# EAGLE design serial_max232 (EAGLE 8.0.1)
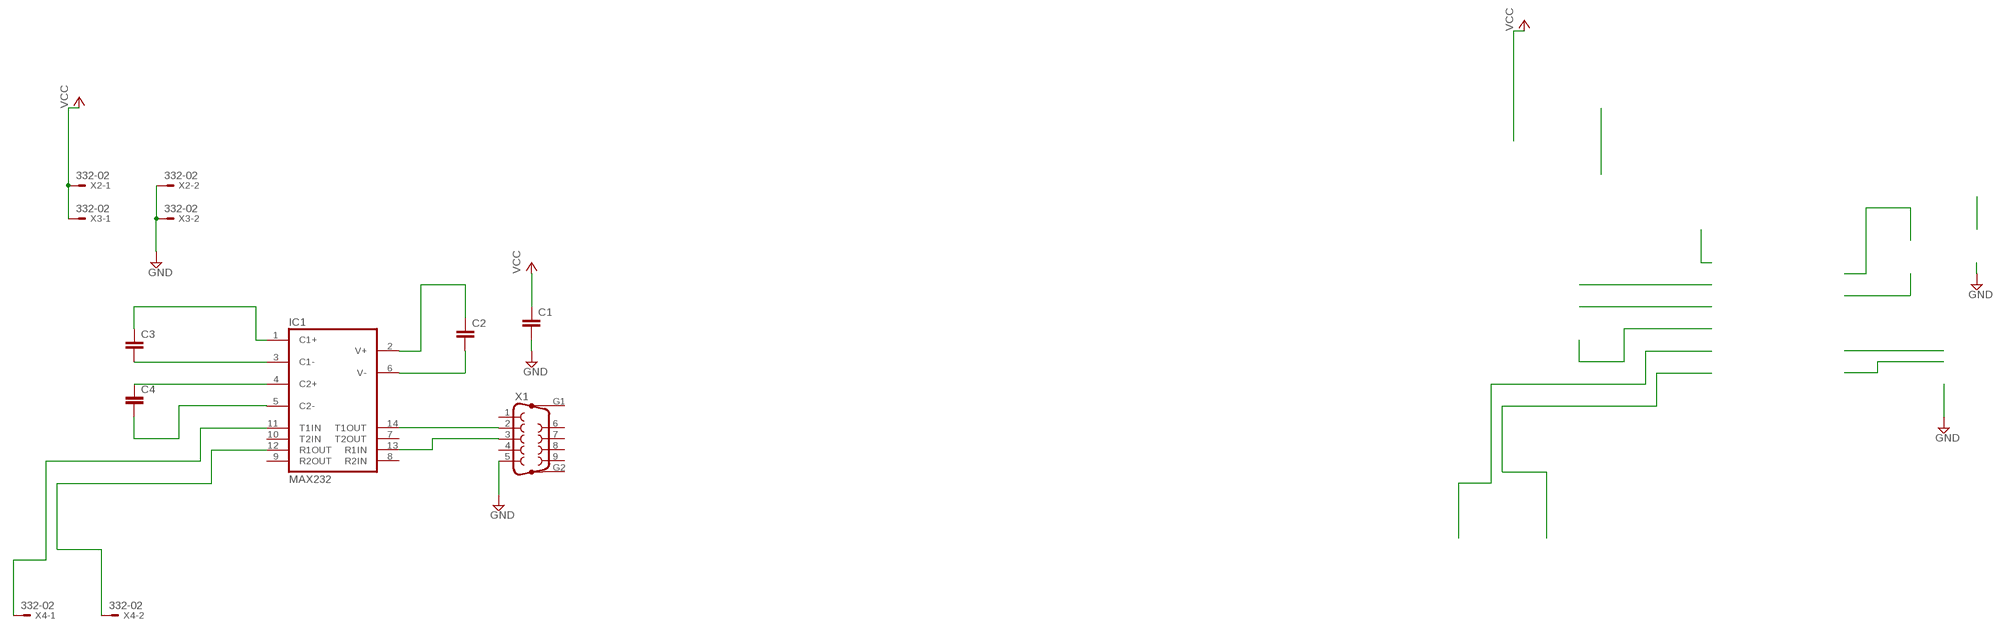
[diagram p0: schematic, sheet 1]

## Parts
C1  C5/7.2  [C5B7.2]
C2  C5/7.2  [C5B7.2]
C3  C5/7.2  [C5B7.2]
C4  C5/7.2  [C5B7.2]
IC1  MAX232  [DIL16]
X1  F09VP  [F09VP]
X2  332-02  [332-02]
X3  332-02  [332-02]
X4  332-02  [332-02]

## Nets
GND: C1.2 X1.5 X2.2 X3.2
N$1: IC1.14(T1OUT) X1.2
N$2: IC1.13(R1IN) X1.3
N$4: C3.1 IC1.1(C1+)
N$5: C2.1 IC1.2(V+)
N$6: C2.2 IC1.6(V-)
N$7: C3.2 IC1.3(C1-)
N$8: C4.1 IC1.4(C2+)
N$9: C4.2 IC1.5(C2-)
N$12: IC1.12(R1OUT) X4.2
N$13: IC1.11(T1IN) X4.1
VCC: C1.1 X2.1 X3.1
Unconnected: IC1.7(T2OUT) IC1.8(R2IN) IC1.9(R2OUT) IC1.10(T2IN) X1.1 X1.4 X1.6 X1.7 X1.8 X1.9 X1.G1 X1.G2

## Power pins joined to a net without a drawn wire
GND: IC1.15(GND)
VCC: IC1.16(VCC)

## Library data of the parts
C1-C4 = capacitor-wima:C: CAPACITOR naming: grid - package width
IC1 = maxim:MAX232: RS232 TRANSCEIVER; MF: MAXIM; MPN: MAX232ACPE+; OC_FARNELL: 9723773; OC_NEWARK: 68K4544
X1 = con-subd:F09VP: SUB-D; OC_FARNELL: unknown; OC_NEWARK: unknown
X2-X4 = con-garry:332-02: 2 Pin - 2mm Dual Row Source: www.mpe-connector.de / garry_shortform_2012.pdf

## Board
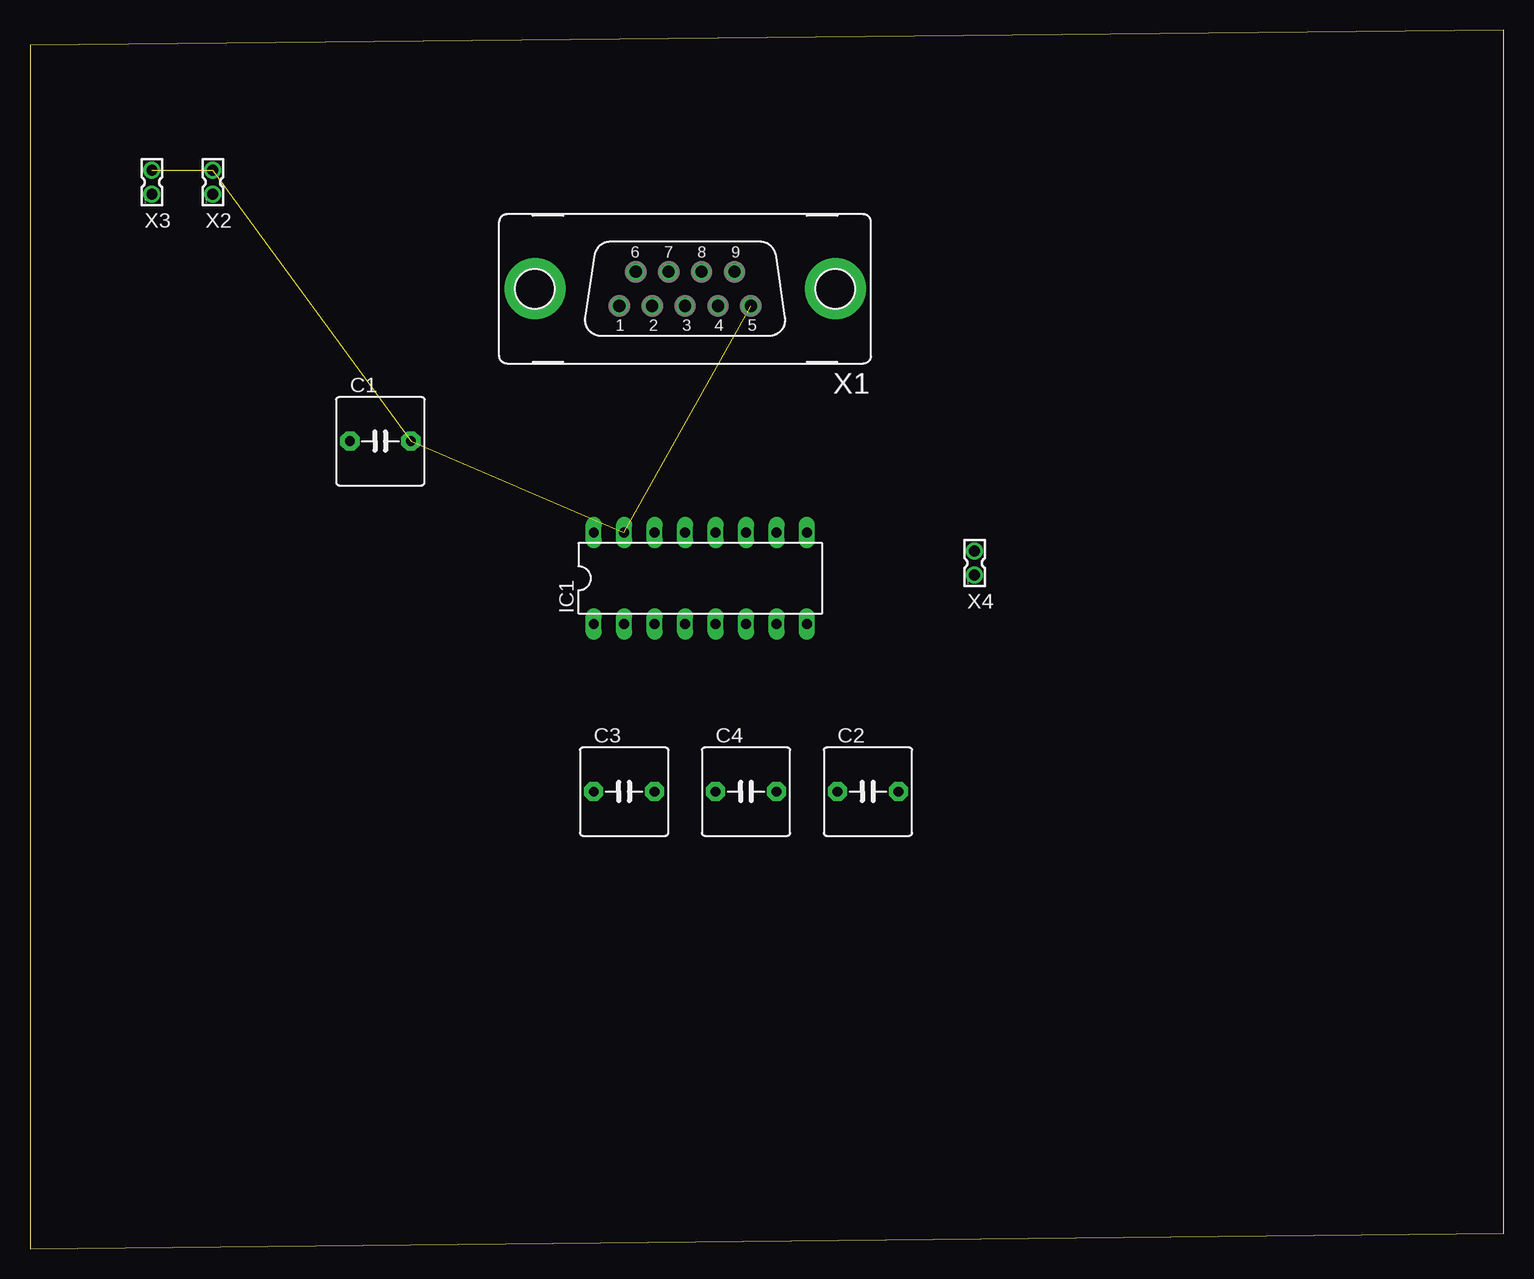
[diagram p1: board, top side]
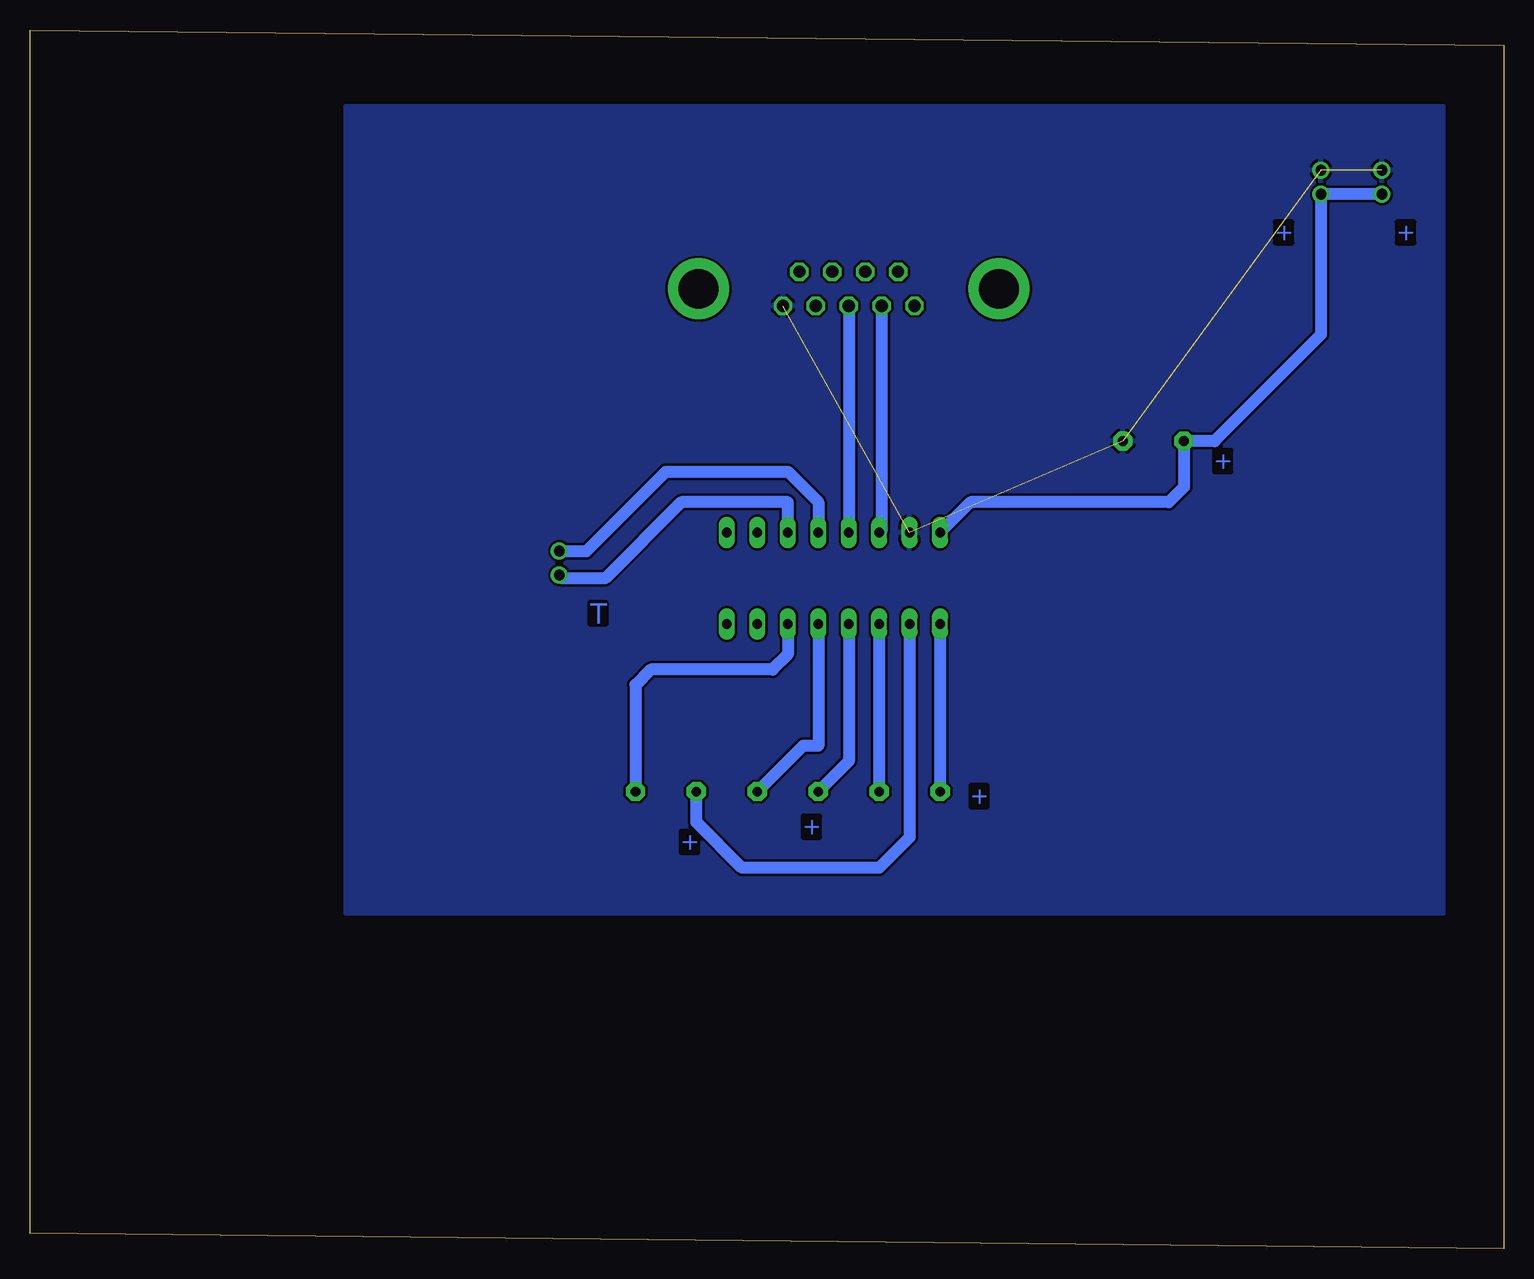
[diagram p2: board, bottom side, seen from below]

Size 122.86 x 101.59 mm. Coordinates in mm from the lower left corner, seen from the top.
Outline: 0,0 122.86,1.27 122.86,101.59 0,100.32 0,0
Copper layers (1*16): Top 0.035mm / dielectric 1.5mm / Bottom 0.035mm
Design rules "default": minimum track width 10mil, minimum drill 24mil, track to track 8mil, track to pad 8mil, pad to pad 8mil, via to via 8mil, smd to smd 8mil, copper to edge 40mil, drill to drill 8mil, minimum pad ring 10mil, minimum via ring 8mil, stop-mask expansion 4mil, vias tented up to drill 0mil, thermal gap 10mil

### Footprints (pad centres in the part's own frame; a part is rotated, then mirrored left to right if it is on the bottom)
C5B7.2 = drill 0.813 pad 1.6 octagon: 1 -2.54,0; 2 2.54,0
DIL16 = drill 0.813 long: 1 -8.89,-3.81; 2 -6.35,-3.81; 3 -3.81,-3.81; 4 -1.27,-3.81; 5 1.27,-3.81; 6 3.81,-3.81; 7 6.35,-3.81; 8 8.89,-3.81; 9 8.89,3.81; 10 6.35,3.81; 11 3.81,3.81; 12 1.27,3.81; 13 -1.27,3.81; 14 -3.81,3.81; 15 -6.35,3.81; 16 -8.89,3.81
F09VP = drill 1.016 octagon: 1 5.486,1.422; 2 2.743,1.422; 3 0,1.422; 4 -2.743,1.422; 5 -5.486,1.422; 6 4.115,-1.422; 7 1.372,-1.422; 8 -1.372,-1.422; 9 -4.115,-1.422 | drill 3.302 pad 5.08: G1 -12.522,0; G2 12.522,0
332-02 = drill 0.9 pad 1.27: 1 0,-1; 2 0,1

### Placement (x,y rotation side)
C1  29.21,67.31 0 top
C2  69.85,38.1 0 top
C3  49.53,38.1 0 top
C4  59.69,38.1 0 top
IC1  55.88,55.88 0 top
X1  54.61,80.01 180 top
X2  15.24,88.9 0 top
X3  10.16,88.9 0 top
X4  78.74,57.15 0 top

### Tracks (layer width: path | path; a pad name or v marks a point on that pad's centre or on a via)
GND  (4 unrouted)
  pour Bottom: 5.08,95.25 5.08,27.94 96.52,27.94 96.52,95.25
N$1
  Bottom 1.016: X1.2 51.87,59.89 IC1.14
N$2
  Bottom 1.016: X1.3 IC1.13
N$4
  Bottom 1.016: IC1.1 C3.1
N$5
  Bottom 1.016: IC1.2 49.53,34.29 52.07,31.75 63.5,31.75 67.31,35.56 C2.1
N$6
  Bottom 1.016: IC1.6 59.69,49.53 60.96,48.26 71.12,48.26 72.39,46.99 C2.2
N$7
  Bottom 1.016: IC1.3 C3.2
N$8
  Bottom 1.016: IC1.4 54.61,40.64 C4.1
N$9
  Bottom 1.016: IC1.5 57.15,41.91 58.42,41.91 C4.2
N$12
  Bottom 1.016: X4.2 76.47,58.15 69.85,64.77 59.69,64.77 57.15,62.23 IC1.12
N$13
  Bottom 1.016: IC1.11 59.69,62.23 68.58,62.23 74.93,55.88 78.47,55.88 X4.1
VCC
  Bottom 1.016: X3.1 X2.1 15.24,76.2 24.13,67.31 C1.1 26.67,63.5 27.94,62.23 44.45,62.23 IC1.16

### Text on the board
Bottom: + | + | + | T | + | + | +